# Altium project Voltage Boost Converter.PrjPcb
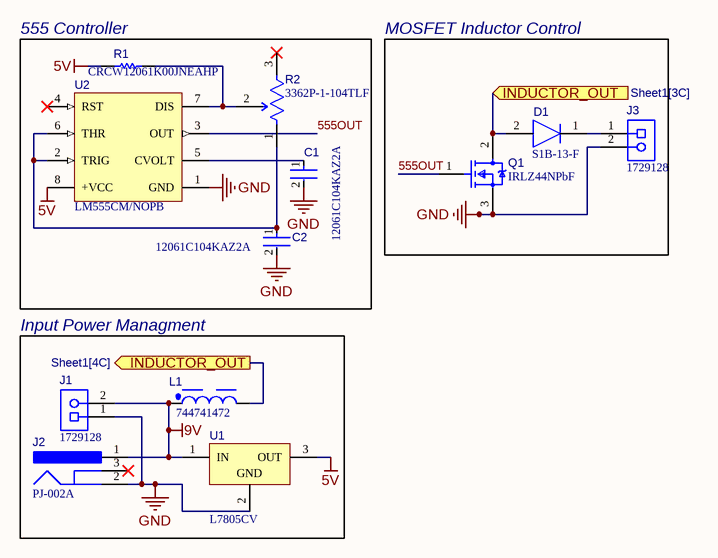
[diagram p0: Sheet1.SchDoc]
1 sheet, 12 parts. Net scope: flat (ports and power ports of the same name join across sheets).
Board file: PCB1.PcbDoc

## Sheet Sheet1.SchDoc
size B; SheetNumber: 1; SheetTotal: 1

### Parts
C1  12061C104KAZ2A  [FP-1206-L_3_2_0_2-W_1_6_0-MFG]
C2  12061C104KAZ2A  [FP-1206-L_3_2_0_2-W_1_6_0-MFG]
D1  S1B-13-F  [FP-SMA-MFG]
J1  1729128  [PHOE-1729128-2_V]
J2  PJ-002A  [CUI-PJ-002A_V]
J3  1729128  [PHOE-1729128-2_V]
L1  744741472  [WE-TI_8055]
Q1  IRLZ44NPbF  [FP-PG-TO220-3-MFG]
R1  CRCW12061K00JNEAHP  [RESC3116X65X50LL20T20]
R2  3362P-1-104TLF  [FP-3362P-T-MFG]
U1  L7805CV  [TO220]
U2  LM555CM/NOPB  [D0008A_M]

### Blocks framed on the sheet
555 Controller: C1 C2 R1 R2 U2
MOSFET Inductor Control: D1 J3 Q1
Input Power Managment: J1 J2 L1 U1

### Ports
INDUCTOR_OUT (in, see Sheet1[3C]), INDUCTOR_OUT (out, see Sheet1[4C])

### Nets
5V: R1.1 U1.3(OUT) U2.8(+VCC)
9V: J1.2 J2.1 L1.1 U1.1(IN)
GND: C1.2 C2.2 J1.1 J2.2 J3.2 Q1.3(S) U1.2(GND) U2.1(GND)
555OUT: Q1.1(G) U2.3(OUT)
NetC1_1: C1.1 U2.5(CVOLT)
NetC2_1: C2.1 R2.1(CCW) U2.2(TRIG) U2.6(THR)
NetD1_1: D1.1(C) J3.1
NetD1_2: D1.2(A) L1.2 Q1.2(D) ; port INDUCTOR_OUT
NetR1_2: R1.2 R2.2(WIPER) U2.7(DIS)

Not connected (* = marked no-connect by the designer): J2 3*; R2 3(CW)*; U2 4(RST)*

### Library data of the parts
C1 C2 = CMP-04427-004798-1: General Purpose Ceramic Capacitor, 1206, 100nF, 10%, X7R, 15%, 100V; Features: Soft Termination; Termination: SMD/SMT; Mount: Surface Mount; Tolerance: 10%; Voltage Rating: 100V; Length: 3.2mm; Case/Package: 1206; Case Code (Metric): 3216; RoHS Compliant: Yes; Package Quantity: 1; Max Operating Temperature: 125°C; Voltage Rating (DC): 100V; Min Operating Temperature: -55°C; Number of Pins: 2; Packaging: Tape and Reel; Width: 0.063inch; REACH SVHC: No SVHC; Lead Free: Lead Free; Construction: Flat; Capacitance: 100nF; Radiation Hardening: No; Case Code (Imperial): 1206; Thickness: 0.05inch; Series: FLEXITERM®; Depth: 1.6mm; Dielectric: X7R
D1 = CMP-12791-000051-1: DIODE GEN PURP 100V 1A SMA; Peak Non-Repetitive Surge Current: 30A; Element Configuration: Single; Recovery Time: 1.8us; Peak Reverse Current: 5uA; Forward Voltage: 1.1V; Capacitance: 10pF; Polarity: Standard; Reverse Recovery Time: 3us; Output Current: 1A; Width: 2.92mm; Current Rating: 1A; Max Surge Current: 30A; Length: 4.6mm; Contact Plating: Tin; Radiation Hardening: No; Max Repetitive Reverse Voltage (Vrrm): 100V; Min Operating Temperature: -65°C; Forward Current: 1A; Lead Free: Lead Free; Weight: 0.002258oz; Mount: Surface Mount; Number of Pins: 2; Packaging: Tape and Reel; Reverse Voltage (DC): 100V; Max Operating Temperature: 150°C; Termination: SMD/SMT; Max Reverse Voltage (DC): 100V; Voltage Rating (DC): 100V; Package Quantity: 5000; Average Rectified Current: 1A; Height: 2.1mm; Case/Package: SMA
J1 J3 = CMP-2000-05815-1: PCB Terminal Block, 13.5 A, 400 V, 2-Pin THD, RoHS, Bulk; Manufacturer: Phoenix Contact; Package Version: 03/2015; No. of Rows: 1; Pitch: 5.08mm; No. of Positions: 2; Voltage Rating: 400V; Current Rating: 13500mA; Manufacturer URL: http://www.phoenixcontact.com/; Datasheet URL: https://datasheet.ciiva.com/16046/1729128-16046181.pdf; RoHS: TRUE; Package URL: https://www.phoenixcontact.com/online/portal/pi/pxc/product_detail_page/!ut/p/b1/3VdJjqNKFDxLH8AFycySyWY2ozFsEPOMMQaDOX1XedGL_1Vdm5YXJleknhSKeBkvI6EA8ncAo3AYoDhBQGco6KN7VURTdemj9us_IEKEZo_YHiPAEWEFmDGOHMORkqKYCORBZxgL7ZoaZYcbFFUZ3fqxSY6GOuxydWUuHqz1ynmMFygu583Bob0Ewr6Sd_l-5m-kAueHiB0jpRwZwe58wwtkpxtMYd_LmGcDRU02dRNEyWt6Y2ti5pSyJ_reIkzIulrqApdnbT11V5jnCKbYNCvhEM1MCpPByat_X379-iThf08CI5GfOPqfBeS3BRoBOdD55AKVv0iLwCMq-2BrzXWSGRH7pUGD9uwXQjiph3xL0DKQwdGa0JImiIOmBNOestqgwTHSSs2oOep-78apyXQBvNi8ZLaFjvjWvcaUEBu0MC6Wbe-d6mB0FAebo2lUWinqYaZs5DAYzV0RP9yitUjnGJ0iI9xhZkT42OCQNUJJhkgWINNQLP2JFP6OpMg3JCVg70jqHT0lvKOnhHf0lPuOnnLf0VPuWx6_dxwUIvwk5WMkT0kLL1mh61l2yZVSzG3pYV_bqo-mj6uMKwKwdnnW8Jh5RTOJzMOA5c-eJDaZQw4mTMPH02PvS_ZAqNVjVTo2WyYLkwH_KU1mmmG5kjRhDqPXLwwVHvVOjCM60-fpXvTDfMGW1PVFVS1r4e4yVDk4ZdNbkUHvqPqQSeian4UD39fNKmachqdJ1NJbyk8rXT9mXTvPk3oE5meulKGgiruPJek-4I9hTT6G8ZLOyRSm2RRVbThERQad5OS28hdt4YW4vG0stgYYzsWsK4_7y6DZMjJSCqri1kyiZR5vD7pwIrNR7QwPHTcLTI5qT7eRlpHrdGiupYlqQDJ7zy_CND8fWWBoLRXxk1RVcXiBQwbTD4Xi7KL-FuO94t9xaqweXzH; PartNumber: 1729128; Package Description: 2-Pin Through Hole Device, Body 8.1 x 10.16 mm, Pitch 5.08 mm; Datasheet Version: 12/2013; Mounting Technology: ThroughHole; Orientation: Horizontal; Package Reference: 1729128-2; Packing: Bulk
J2 = CMP-2000-06895-2: Through Hole Right Angle DC Power Jack, 2.5 A, 2 mm Center Pin, 3 Position, -25 to 85 degC, RoHS, Bulk; Manufacturer: CUIInc.; Brand: CUI; Inside Contact Diameter: 2mm; Voltage Rating: 24V; Outside Contact Diameter: 6.5mm; Current Rating: 2.5A; Insulation Resistance: 50MOhms; Contact Gender: Male; Connector Type: DCPowerJack; Datasheet Version: Rev. 1.03, 04/2016; Housing Material: PolybutyleneTerephthalate(PBT); Operating Temperature Range: -25Cto+85C; Termination Style: ThroughHole; Product Category: DCPowerConnectors; Mounting Technology: ThroughHole; Mounting Style: ThroughHole; Factory Pack Quantity: 500; Contact Plating: Nickel; Package Reference: PJ-002A; Mounting Angle: Right; Package Description: 3-Pin Through Hole Device, Body 14.4 x 9 mm, Height 11 mm; Flammability Rating: UL94V-0; Manufacturer URL: http://www.cui.com/; Product: Jacks; Contact Material: Copper; Datasheet URL: http://www.cui.com/product/resource/pj-002a.pdf; RoHS: True
L1 = CMP-0225-00009-3: NexarPartId: 22803390; Inductance: 4.7mH; Core Material: Ferrite; Shielding: Unshielded; Test Frequency: 1kHz; Self Resonant Frequency: 1.3MHz; Inductance Tolerance: 5%; Tolerance: 10%; DC Resistance (DCR): 21.18Ω; Saturation Current: 150mA; Series Resistance: 23Ω; Length: 8.5mm; Composition: Wirewound; Ambient Temperature Range Low: -40°C; Ambient Temperature Range High: 85°C; REACH SVHC: Unknown; Max Operating Temperature: 125°C; Number of Pins: 2; Case/Package: Radial; RoHS: Compliant; Lead Pitch: 5mm; Height - Seated (Max): 5.9944mm; Termination: Radial; Mount: Radial, Through Hole; RMS Current (Irms): 150mA; Height: 5.5mm; Min Operating Temperature: -40°C; Diameter: 8.5mm; Width: 8.5mm; Current Rating: 150mA; Max DC Current: 150mA
Q1 = CMP-32901-000488-1: MOSFET N-CH 55V 47A TO220AB; Turn-On Delay Time: 11ns; Gate to Source Voltage (Vgs): 16V; Element Configuration: Single; Rds On Max: 22mR; Turn-Off Delay Time: 26ns; Max Power Dissipation: 110W; Threshold Voltage: 2V; Drain to Source Resistance: 35mR; Input Capacitance: 1.7nF; Continuous Drain Current (ID): 47A; Case/Package: TO-220; Lead Free: Lead Free; Halogen Free: Halogen Free; Packaging: Rail/Tube; Length: 0.414inch; Min Operating Temperature: -55°C; REACH SVHC: No SVHC; Number of Pins: 3; Width: 0.185inch; Drain to Source Voltage (Vdss): 55V; Power Dissipation: 110W; RoHS Compliant: Yes; Max Operating Temperature: 175°C; Height: 0.6inch; Max Dual Supply Voltage: 55V; Drain to Source Breakdown Voltage: 55V; Mount: Through Hole
R1 = CMP-2003-04880-1: Manufacturer: Vishay Dale; Part Number: CRCW12061K00JNEAHP
R2 = CMP-07234-000031-1: TRIMMER 100K OHM 0.5W PC PIN TOP; Max Power Dissipation: 500mW; Temperature Coefficient: 100ppm/°C; Resistance: 100kR; Tolerance: 10%; Termination: PC Pin; Width: 0.26inch; RoHS Compliant: Yes; Power Rating: 500mW; Technology: CERMET; Mount: Through Hole; Length: 0.275inch; Resistor Type: Cermet; Package Quantity: 50; Height: 0.185inch; Series: Trimpot® 3362 - Sealed; Max Operating Temperature: 125°C; Packaging: Rail/Tube; Min Operating Temperature: -55°C
U1 = CMP-0244-00483-1: Positive Voltage Regulator, 5V, 3-Pin TO-220; PackageDescription: TO, Thru-Hole, Vertical, Heatsink Mounted; 3 In-Line Leads; Pitch 2.54 mm; ComponentLink2Description: Datasheet; PackageReference: TO220; ComponentLink3URL: http://www.st.com/internet/com/TECHNICAL_RESOURCES/TECHNICAL_LITERATURE/PACKAGE_INFORMATION/CD00004649.pdf; DatasheetVersion: 16/11/2011; ComponentLink1Description: Manufacturer URL; ComponentLink1URL: http://www.st.com; PackageVersion: ver3.0; ComponentLink3Description: Package Specification; ComponentLink2URL: http://www.st.com/internet/com/TECHNICAL_RESOURCES/TECHNICAL_LITERATURE/DATASHEET/CD00000444.pdf
U2 = CMP-0056-00105-3: Timer, 8-pin Narrow SOIC, Pb-Free; Manufacturer: Texas Instruments; PowerWise: N; CompType: Analog IC; PackageTopMarking: NSZXTT*LM*555CM; PinCount: 8; PackageDescription: SOIC Narrow, 4.9 x 3.9 x 1.45mm, 8 Lead, 1.27mm Pitch; RoHS: Y; ComponentLink1Description: Datasheet URL; ComponentLink1URL: http://www.ti.com/general/docs/lit/getliterature.tsp?genericPartNumber=LM555&fileType=pdf; PackageReference: D0008A; Code_JEDEC: MS-012-AA; Code_IPC: SOIC127P600-8